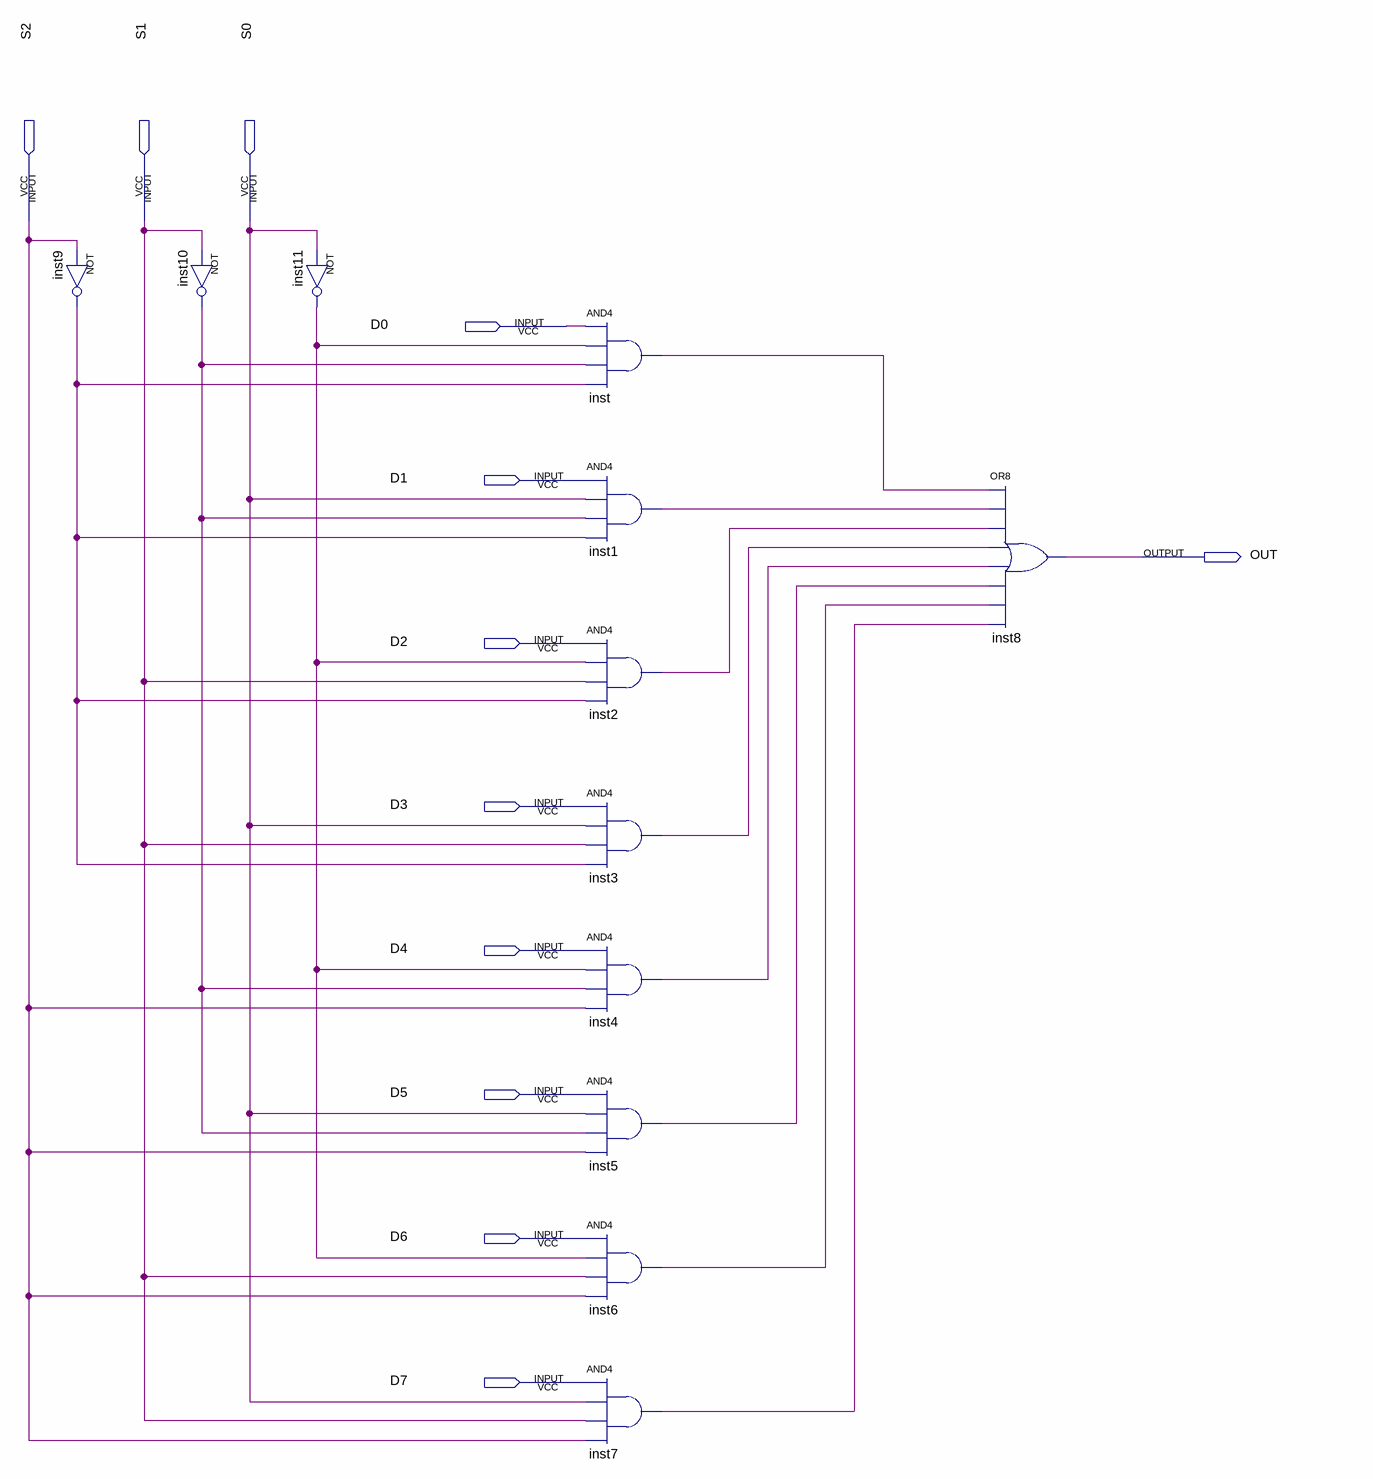
[diagram p0: schematic sheet]
// Quartus schematic MUX81.bdf as structural Verilog: 12 symbols, 12 pins
module MUX81 (
  input  S2,
  input  S1,
  input  S0,
  input  D0,
  input  D1,
  input  D2,
  input  D3,
  input  D4,
  input  D5,
  input  D6,
  input  D7,
  output OUT
);

  wire inst1_out, inst2_out, inst3_out, inst4_out, inst5_out, inst6_out, inst7_out, inst9_out, inst10_out,
       inst11_out, inst_out;

  not inst9 (inst9_out, S2);
  not inst10 (inst10_out, S1);
  not inst11 (inst11_out, S0);
  and inst (inst_out, D0, inst11_out, inst10_out, inst9_out);
  and inst1 (inst1_out, D1, S0, inst10_out, inst9_out);
  and inst2 (inst2_out, D2, inst11_out, S1, inst9_out);
  and inst3 (inst3_out, D3, S0, S1, inst9_out);
  and inst4 (inst4_out, D4, inst11_out, inst10_out, S2);
  and inst5 (inst5_out, D5, S0, inst10_out, S2);
  and inst6 (inst6_out, D6, inst11_out, S1, S2);
  and inst7 (inst7_out, D7, S0, S1, S2);
  or inst8 (OUT, inst_out, inst1_out, inst2_out, inst3_out, inst4_out, inst5_out, inst6_out, inst7_out);
endmodule
